# EasyEDA Pro project ProPrj_cheap-board-max-10_2026-05-07.epro, board PCB1
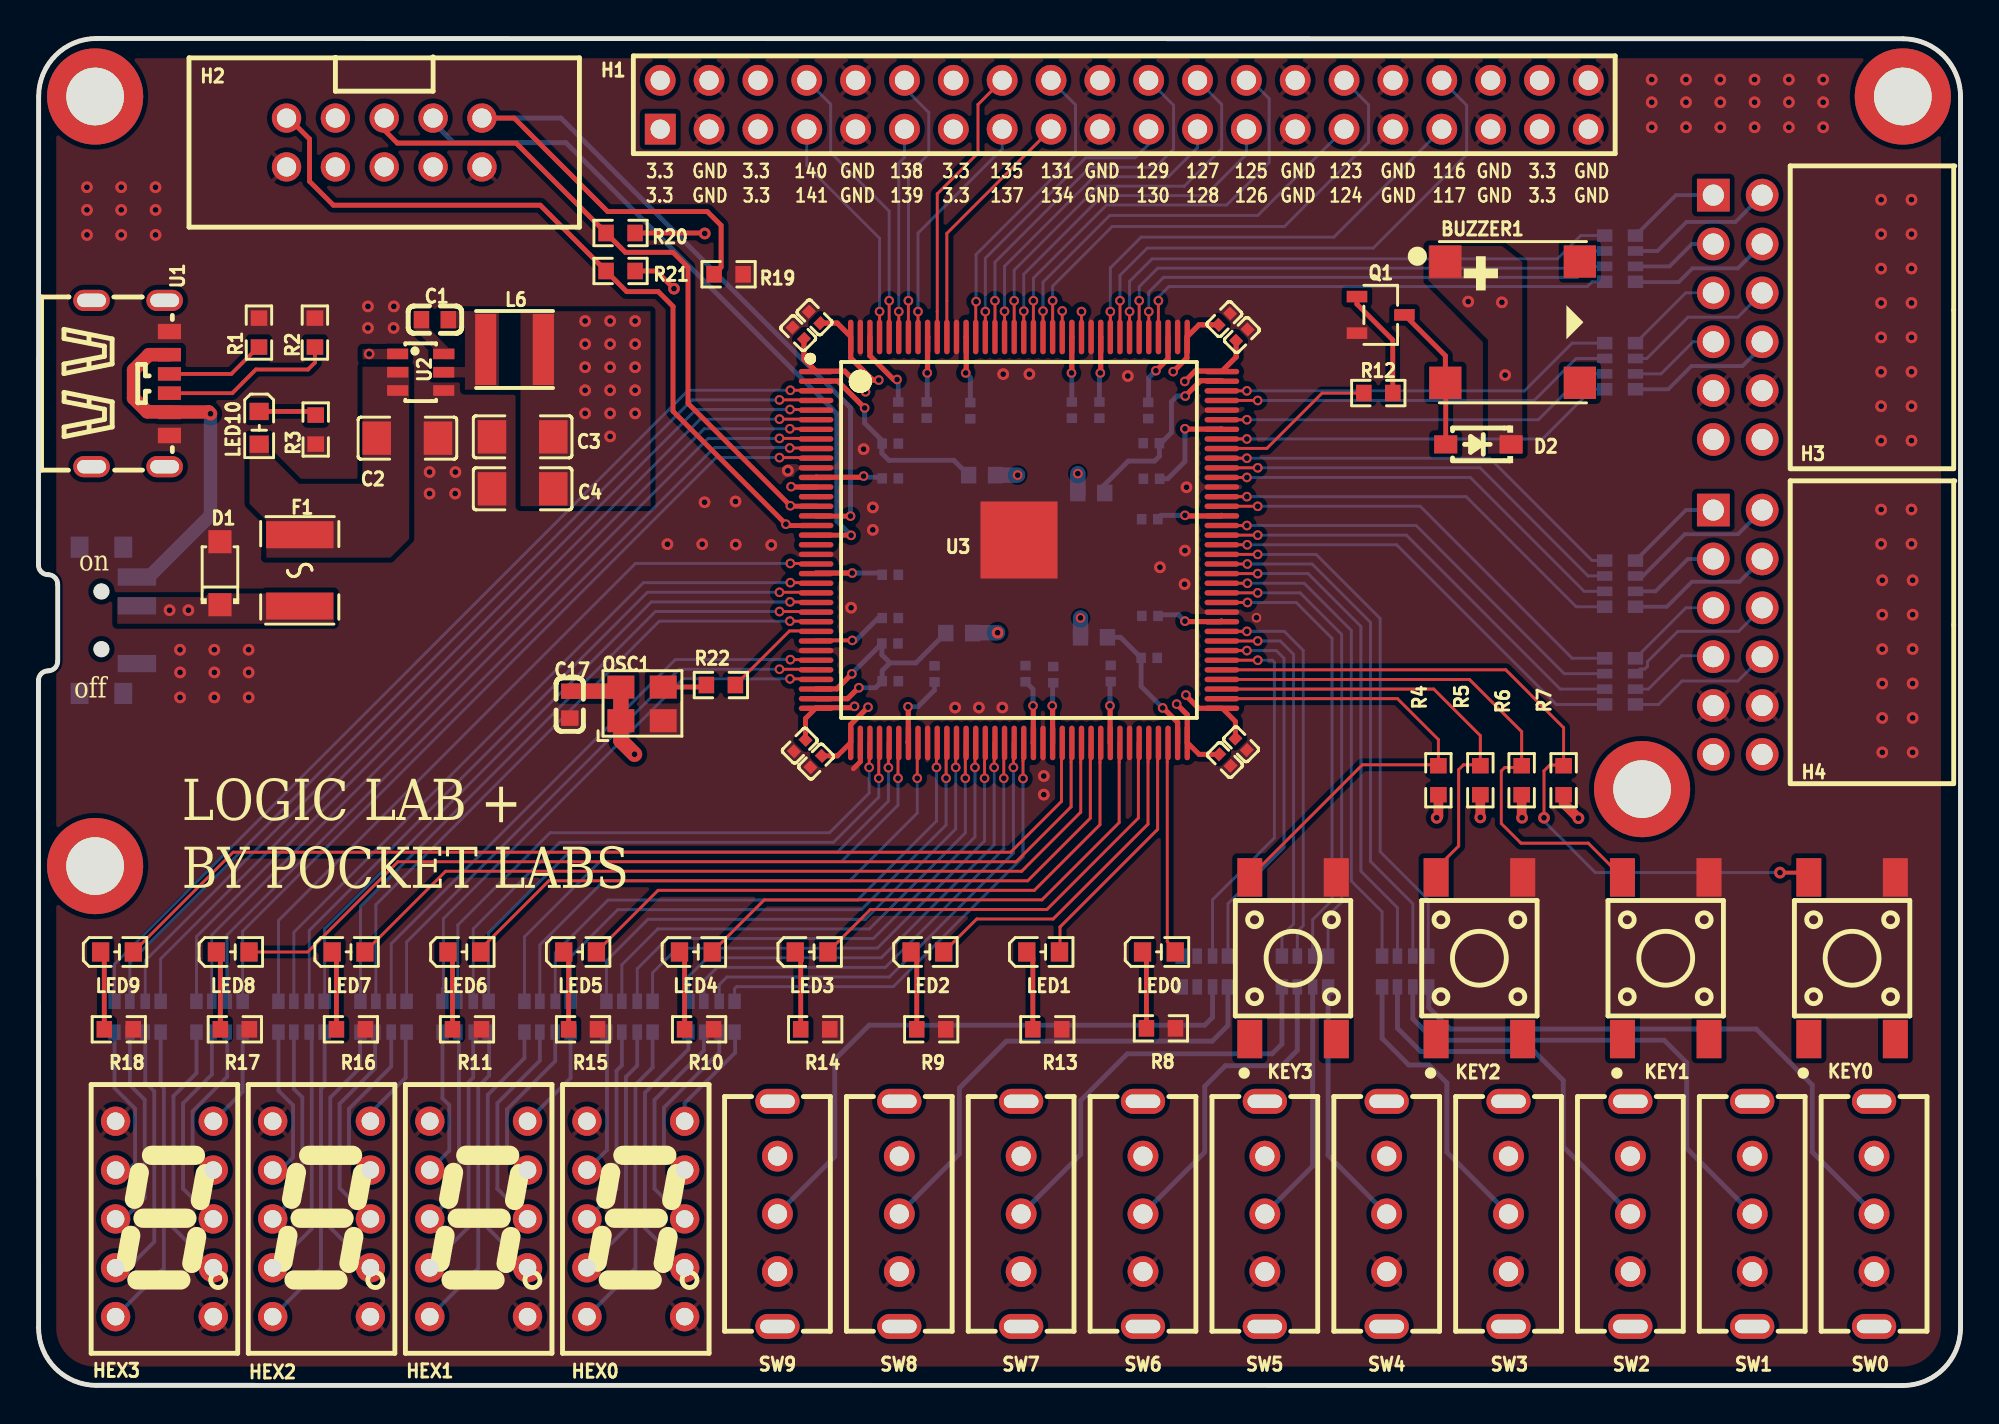
[diagram p6: board, top side]
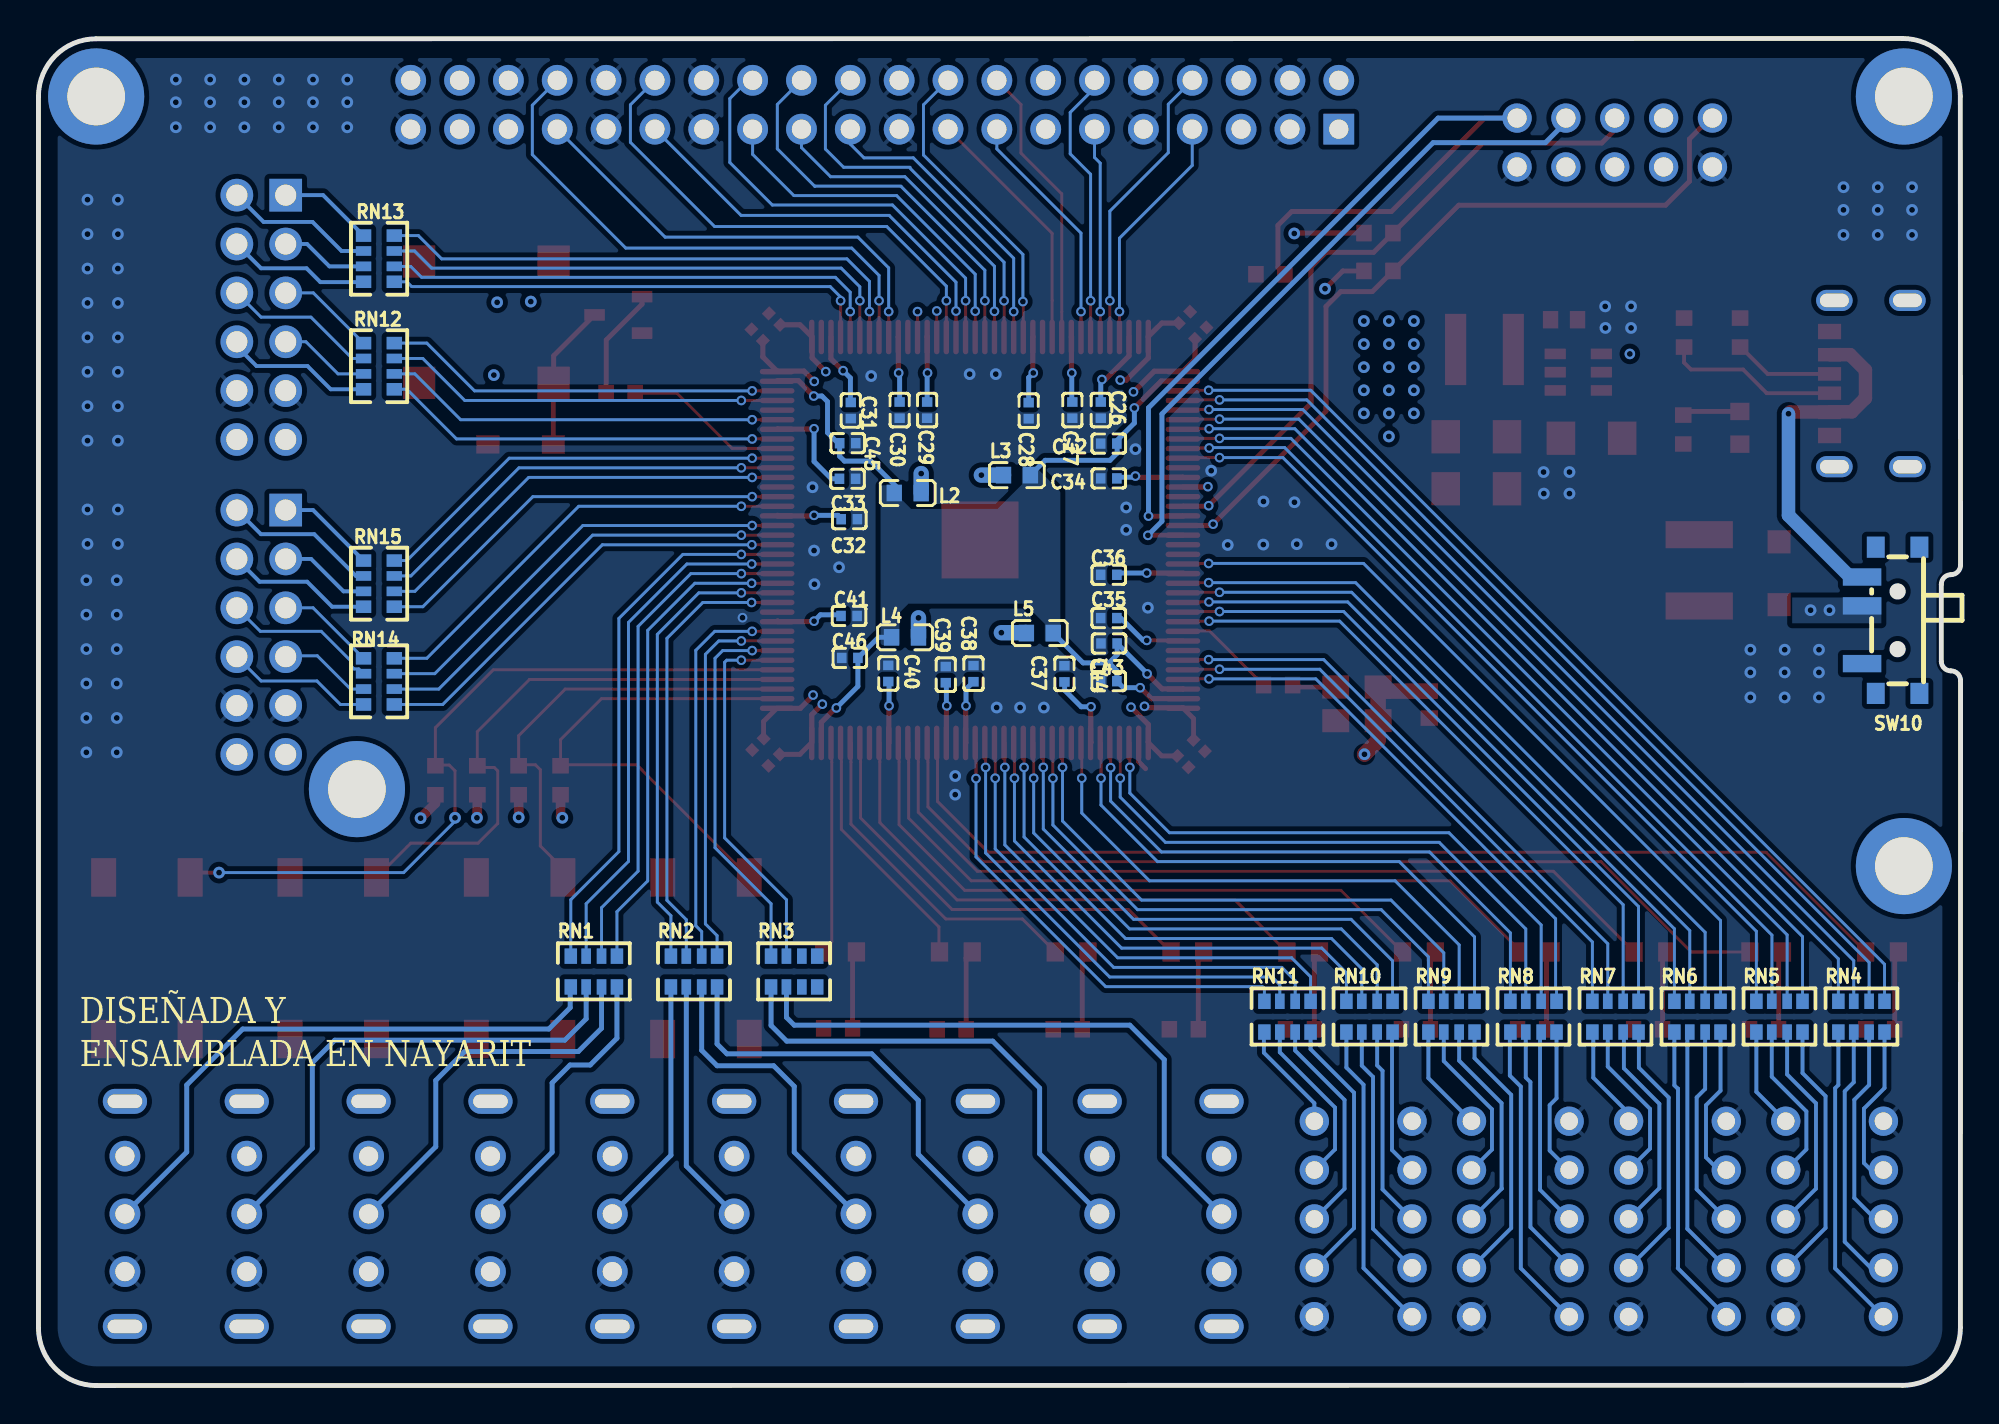
[diagram p7: board, bottom side, seen from below]

Outline 99.95 x 70.02 mm; copper layers: Top Layer, Inner1, Inner2, Bottom Layer. Coordinates in mm from the lower left corner of the outline.
Outline path: 0,36.65 arc(0.15,37) 0.5,37.15 arc(0.85,37.29) 1,37.65 1,41.65 arc(0.85,42) 0.5,42.15 arc(0.15,42.29) 0,42.65 0.01,67.01 arc(0.89,69.14) 3.02,70.02 96.95,70 arc(99.07,69.12) 99.95,67 99.95,3 arc(99.07,0.88) 96.95,0 3.01,0.01 arc(0.88,0.89) 0.01,3.01 0,36.65
Stack: Top Layer 0.035mm Outer layer thickness 1oz / Dielectric1 0.2104mm 7628 RC49% 8.6mil / Inner1 0.0152mm Inner layer thickness / Dielectric2 1.065mm 1.1mm H/HOZ Copper / Inner2 0.0152mm Inner layer thickness / Dielectric3 0.2104mm 7628 RC49% 8.6mil / Bottom Layer 0.035mm Outer layer thickness 1oz

## Design rules (mm)
template: Custom Config
spacing copperThickness1oz (default): track to track 0.102, other pairs 0.152 to 0.3
spacing copperThickness2oz: track to track 0.203, other pairs 0.152 to 0.3
track width copperThickness1oz (default): min 0.127, default 0.254, max 2.54
track width copperThickness2oz: min 0.203, default 0.254, max 2.54
differential pair differentialPair (default): width min 0.127, default 0.254, max 2.54; gap min 0.152, default 0.152
via viaSize (default): diameter min 0.5, default 0.61, max 10; hole min 0.3, default 0.305, max 6.3

## Placement (name value [footprint] x y rotation side)
BUZZER1  2.7kHz  [BUZ-SMD_4P-L7.5-W7.5-P7.59-TL]  76.65 55.27 0 top
C1  100nF  [C0603]  20.62 55.4 0 top
C2  22uF  [C1206]  19.19 49.24 180 top
C3  22uF  [C1206]  25.18 49.31 0 top
C4  22uF  [C1206]  25.18 46.61 0 top
C17  100nF  [C0603]  27.63 35.39 90 top
C18  100nF  [C0402]  40.36 55.52 315 top
C19  100nF  [C0402]  39.51 54.7 315 top
C20  100nF  [C0402]  61.67 55.43 225 top
C21  100nF  [C0402]  62.58 54.6 225 top
C22  100nF  [C0402]  39.59 33.26 45 top
C23  100nF  [C0402]  40.44 32.43 45 top
C24  100nF  [C0402]  61.7 32.51 135 top
C25  100nF  [C0402]  62.54 33.33 135 top
C26  100nF  [C0402]  44.71 50.7 90 bottom
C27  100nF  [C0402]  46.19 50.7 90 bottom
C28  100nF  [C0402]  48.46 50.67 90 bottom
C29  100nF  [C0402]  53.74 50.7 90 bottom
C30  100nF  [C0402]  55.17 50.7 90 bottom
C31  100nF  [C0402]  57.71 50.68 90 bottom
C32  100nF  [C0402]  57.79 45.03 0 bottom
C33  100nF  [C0402]  57.88 47.13 0 bottom
C34  100nF  [C0402]  44.29 47.15 180 bottom
C35  100nF  [C0402]  44.29 39.89 180 bottom
C36  100nF  [C0402]  44.29 42.14 180 bottom
C37  100nF  [C0402]  46.6 36.99 270 bottom
C38  100nF  [C0402]  51.33 37 270 bottom
C39  100nF  [C0402]  52.77 36.95 270 bottom
C40  100nF  [C0402]  55.76 37.01 270 bottom
C41  100nF  [C0402]  57.8 40 0 bottom
C42  100nF  [C0402]  44.29 48.96 180 bottom
C43  100nF  [C0402]  44.29 36.61 180 bottom
C44  100nF  [C0402]  44.28 38.57 180 bottom
C45  100nF  [C0402]  57.87 48.98 0 bottom
C46  100nF  [C0402]  57.76 37.82 180 bottom
D1  SMF5.0A  [SOD-123FL_L2.7-W1.8-LS3.8-RD]  9.44 42.22 90 top
D2  1N4148W-7-F  [SOD-123_L2.7-W1.6-LS3.7-RD-1]  74.88 48.92 180 top
F1  MF-MSMF050-2  [F1812]  13.59 42.37 270 top
H1  2.54-2*20  [HDR-TH_40P-P2.54-V-F-R2-C20-S2.54]  56.46 66.57 0 top
H2  2.54-2*5P简牛  [IDC-TH_10P-P2.54_C5665]  17.98 64.61 180 top
H3  HX PM2.54-2x6P WC  [HDR-TH_12P-P2.54-H-F-R2-C6-S2.54-W12.7-N]  88.36 55.52 90 top
H4  HX PM2.54-2x6P WC  [HDR-TH_12P-P2.54-H-F-R2-C6-S2.54-W12.7-N]  88.36 39.15 90 top
HEX0  FJ3161AH  [LED-SEG-TH_10P-L14.0-W7.5-P2.54-S5.08-TL]  31.06 8.66 0 top
HEX1  FJ3161AH  [LED-SEG-TH_10P-L14.0-W7.5-P2.54-S5.08-TL]  22.89 8.66 0 top
HEX2  FJ3161AH  [LED-SEG-TH_10P-L14.0-W7.5-P2.54-S5.08-TL]  14.72 8.66 0 top
HEX3  FJ3161AH  [LED-SEG-TH_10P-L14.0-W7.5-P2.54-S5.08-TL]  6.55 8.66 0 top
KEY0  KH-6X6X6H-STM  [SW-SMD_4P-L6.0-W6.0-P4.50-LS9.0_KH-6X6X6H-STM]  94.31 22.21 90 top
KEY1  KH-6X6X6H-STM  [SW-SMD_4P-L6.0-W6.0-P4.50-LS9.0_KH-6X6X6H-STM]  84.62 22.21 90 top
KEY2  KH-6X6X6H-STM  [SW-SMD_4P-L6.0-W6.0-P4.50-LS9.0_KH-6X6X6H-STM]  74.93 22.21 90 top
KEY3  KH-6X6X6H-STM  [SW-SMD_4P-L6.0-W6.0-P4.50-LS9.0_KH-6X6X6H-STM]  65.24 22.21 90 top
L2  BLM18AG601SN1D  [L0603]  54.75 46.39 0 bottom
L3  BLM18AG601SN1D  [L0603]  49.07 47.32 180 bottom
L4  BLM18AG601SN1D  [L0603]  54.89 38.89 0 bottom
L5  BLM18AG601SN1D  [L0603]  47.88 39.11 180 bottom
L6  3.9uH  [IND-SMD_TNR4030S-3R9MTF]  24.76 53.85 0 top
LED0  YLED0603R  [LED0603-FD]  58.26 22.53 180 top
LED1  YLED0603R  [LED0603-FD]  52.24 22.53 180 top
LED2  YLED0603R  [LED0603-FD]  46.22 22.53 180 top
LED3  YLED0603R  [LED0603-FD]  40.2 22.53 180 top
LED4  YLED0603R  [LED0603-FD]  34.18 22.53 180 top
LED5  YLED0603R  [LED0603-FD]  28.16 22.53 180 top
LED6  YLED0603R  [LED0603-FD]  22.14 22.53 180 top
LED7  YLED0603R  [LED0603-FD]  16.12 22.53 180 top
LED8  YLED0603R  [LED0603-FD]  10.1 22.53 180 top
LED9  YLED0603R  [LED0603-FD]  4.08 22.53 180 top
LED10  YLED0603R  [LED0603-FD]  11.48 49.78 90 top
NOREF  -  [Pad_e109]  2.95 27 0 top
NOREF#2  -  [Pad_e107]  96.95 67 0 top
NOREF#3  -  [Pad_e106]  2.95 67 0 top
NOREF#4  -  [Pad_e110]  83.39 31 0 top
OSC1  50MHz  [OSC-SMD_4P-L3.2-W2.5-BL]  31.39 35.43 0 top
Q1  MMBT3904LT1G  [SOT-23-3_L2.9-W1.6-P1.90-LS2.8-BR]  69.8 55.65 180 top
R1  5.1kΩ  [R0603]  11.47 54.73 270 top
R2  5.1kΩ  [R0603]  14.38 54.73 270 top
R3  10kΩ  [R0603]  14.42 49.69 90 top
R4  10kΩ  [R0603]  72.8 31.46 270 top
R5  10kΩ  [R0603]  74.98 31.46 270 top
R6  10kΩ  [R0603]  77.13 31.46 270 top
R7  10kΩ  [R0603]  79.31 31.46 270 top
R8  1kΩ  [R0603]  58.37 18.56 180 top
R9  1kΩ  [R0603]  46.42 18.52 180 top
R10  1kΩ  [R0603]  34.35 18.52 180 top
R11  1kΩ  [R0603]  22.28 18.52 180 top
R12  1kΩ  [R0603]  69.67 51.58 180 top
R13  1kΩ  [R0603]  52.46 18.52 180 top
R14  1kΩ  [R0603]  40.39 18.52 180 top
R15  1kΩ  [R0603]  28.32 18.52 180 top
R16  1kΩ  [R0603]  16.25 18.52 180 top
R17  1kΩ  [R0603]  10.21 18.52 180 top
R18  1kΩ  [R0603]  4.18 18.52 180 top
R19  1kΩ  [R0603]  35.89 57.76 0 top
R20  10kΩ  [R0603]  30.27 59.9 0 top
R21  10kΩ  [R0603]  30.27 57.93 0 top
R22  33  [R0603]  35.49 36.41 180 top
RN1  10kΩ  [RES-ARRAY-SMD_0603-8P-L3.2-W1.6-BL]  71.07 21.52 180 bottom
RN2  10kΩ  [RES-ARRAY-SMD_0603-8P-L3.2-W1.6-BL]  65.86 21.52 180 bottom
RN3  10kΩ  [RES-ARRAY-SMD_0603-8P-L3.2-W1.6-BL]  60.65 21.52 180 bottom
RN4  1kΩ  [RES-ARRAY-SMD_0603-8P-L3.2-W1.6-BL]  5.15 19.17 180 bottom
RN5  1kΩ  [RES-ARRAY-SMD_0603-8P-L3.2-W1.6-BL]  9.42 19.17 180 bottom
RN6  1kΩ  [RES-ARRAY-SMD_0603-8P-L3.2-W1.6-BL]  13.68 19.17 180 bottom
RN7  1kΩ  [RES-ARRAY-SMD_0603-8P-L3.2-W1.6-BL]  17.94 19.17 180 bottom
RN8  1kΩ  [RES-ARRAY-SMD_0603-8P-L3.2-W1.6-BL]  22.21 19.17 180 bottom
RN9  1kΩ  [RES-ARRAY-SMD_0603-8P-L3.2-W1.6-BL]  26.47 19.17 180 bottom
RN10  1kΩ  [RES-ARRAY-SMD_0603-8P-L3.2-W1.6-BL]  30.73 19.17 180 bottom
RN11  1kΩ  [RES-ARRAY-SMD_0603-8P-L3.2-W1.6-BL]  35 19.17 180 bottom
RN12  100Ω  [RES-ARRAY-SMD_0603-8P-L3.2-W1.6-BL]  82.24 52.98 270 bottom
RN13  100Ω  [RES-ARRAY-SMD_0603-8P-L3.2-W1.6-BL]  82.24 58.57 270 bottom
RN14  100Ω  [RES-ARRAY-SMD_0603-8P-L3.2-W1.6-BL]  82.24 36.6 270 bottom
RN15  100Ω  [RES-ARRAY-SMD_0603-8P-L3.2-W1.6-BL]  82.24 41.68 270 bottom
SW0  SS12F44G4  [SW-TH_SHOU-HAN_SS12F44G4]  95.45 8.92 90 top
SW1  SS12F44G4  [SW-TH_SHOU-HAN_SS12F44G4]  89.11 8.92 90 top
SW2  SS12F44G4  [SW-TH_SHOU-HAN_SS12F44G4]  82.78 8.92 90 top
SW3  SS12F44G4  [SW-TH_SHOU-HAN_SS12F44G4]  76.44 8.92 90 top
SW4  SS12F44G4  [SW-TH_SHOU-HAN_SS12F44G4]  70.11 8.92 90 top
SW5  SS12F44G4  [SW-TH_SHOU-HAN_SS12F44G4]  63.77 8.92 90 top
SW6  SS12F44G4  [SW-TH_SHOU-HAN_SS12F44G4]  57.43 8.92 90 top
SW7  SS12F44G4  [SW-TH_SHOU-HAN_SS12F44G4]  51.1 8.92 90 top
SW8  SS12F44G4  [SW-TH_SHOU-HAN_SS12F44G4]  44.76 8.92 90 top
SW9  SS12F44G4  [SW-TH_SHOU-HAN_SS12F44G4]  38.43 8.92 90 top
SW10  MK-12C02-G020  [SW-SMD_MK-12C02-G020]  3.63 39.77 90 bottom
U1  USB-TYPE-C-009  [TYPE-C-SMD_TYPE-C-6P]  4.79 52.08 270 top
U2  AP63203WU-7  [TSOT-26_L2.9-W1.6-P0.95-LS2.8-BL]  19.88 52.67 270 top
U3  10M02SCE144C8G  [EQFP-144_L20.0-W20.0-P0.50-LS22.0-BL-EP4.0]  50.99 43.95 270 top

## Footprints (pads in the part's own frame, mm; a bottom-side part is the same pattern mirrored in y, then rotated)
BUZ-SMD_4P-L7.5-W7.5-P7.59-TL
  rect 1.681x1.68 smd: 1(-3.498,3.15) 2(-3.498,-3.15) 3(3.498,-3.15) 4(3.498,3.15)
C0402
  rect 0.5x0.54 smd: 1(-0.42,0) 2(0.42,0)
C0603
  rect 0.8x0.9 smd: 1(-0.7,0) 2(0.7,0)
C1206
  rect 1.485x1.728 smd: 1(-1.593,0) 2(1.593,0)
EQFP-144_L20.0-W20.0-P0.50-LS22.0-BL-EP4.0
  oval 0.28x1.8 smd: 1(-8.75,-10.55) 2(-8.25,-10.55) 3(-7.75,-10.55) 4(-7.25,-10.55) 5(-6.75,-10.55) 6(-6.25,-10.55) 7(-5.75,-10.55) 8(-5.25,-10.55) 9(-4.75,-10.55) 10(-4.25,-10.55) 11(-3.75,-10.55) 12(-3.25,-10.55) 13(-2.75,-10.55) 14(-2.25,-10.55) 15(-1.75,-10.55) 16(-1.25,-10.55) 17(-0.75,-10.55) 18(-0.25,-10.55) 19(0.25,-10.55) 20(0.75,-10.55) 21(1.25,-10.55) 22(1.75,-10.55) 23(2.25,-10.55) 24(2.75,-10.55) 25(3.25,-10.55) 26(3.75,-10.55) 27(4.25,-10.55) 28(4.75,-10.55) 29(5.25,-10.55) 30(5.75,-10.55) 31(6.25,-10.55) 32(6.75,-10.55) 33(7.25,-10.55) 34(7.75,-10.55) 35(8.25,-10.55) 36(8.75,-10.55) 73(8.75,10.55) 74(8.25,10.55) 75(7.75,10.55) 76(7.25,10.55) 77(6.75,10.55) 78(6.25,10.55) 79(5.75,10.55) 80(5.25,10.55) 81(4.75,10.55) 82(4.25,10.55) 83(3.75,10.55) 84(3.25,10.55) 85(2.75,10.55) 86(2.25,10.55) 87(1.75,10.55) 88(1.25,10.55) 89(0.75,10.55) 90(0.25,10.55) 91(-0.25,10.55) 92(-0.75,10.55) 93(-1.25,10.55) 94(-1.75,10.55) 95(-2.25,10.55) 96(-2.75,10.55) 97(-3.25,10.55) 98(-3.75,10.55) 99(-4.25,10.55) 100(-4.75,10.55) 101(-5.25,10.55) 102(-5.75,10.55) 103(-6.25,10.55) 104(-6.75,10.55) 105(-7.25,10.55) 106(-7.75,10.55) 107(-8.25,10.55) 108(-8.75,10.55)
  oval 1.8x0.28 smd: 37(10.55,-8.75) 38(10.55,-8.25) 39(10.55,-7.75) 40(10.55,-7.25) 41(10.55,-6.75) 42(10.55,-6.25) 43(10.55,-5.75) 44(10.55,-5.25) 45(10.55,-4.75) 46(10.55,-4.25) 47(10.55,-3.75) 48(10.55,-3.25) 49(10.55,-2.75) 50(10.55,-2.25) 51(10.55,-1.75) 52(10.55,-1.25) 53(10.55,-0.75) 54(10.55,-0.25) 55(10.55,0.25) 56(10.55,0.75) 57(10.55,1.25) 58(10.55,1.75) 59(10.55,2.25) 60(10.55,2.75) 61(10.55,3.25) 62(10.55,3.75) 63(10.55,4.25) 64(10.55,4.75) 65(10.55,5.25) 66(10.55,5.75) 67(10.55,6.25) 68(10.55,6.75) 69(10.55,7.25) 70(10.55,7.75) 71(10.55,8.25) 72(10.55,8.75) 109(-10.55,8.75) 110(-10.55,8.25) 111(-10.55,7.75) 112(-10.55,7.25) 113(-10.55,6.75) 114(-10.55,6.25) 115(-10.55,5.75) 116(-10.55,5.25) 117(-10.55,4.75) 118(-10.55,4.25) 119(-10.55,3.75) 120(-10.55,3.25) 121(-10.55,2.75) 122(-10.55,2.25) 123(-10.55,1.75) 124(-10.55,1.25) 125(-10.55,0.75) 126(-10.55,0.25) 127(-10.55,-0.25) 128(-10.55,-0.75) 129(-10.55,-1.25) 130(-10.55,-1.75) 131(-10.55,-2.25) 132(-10.55,-2.75) 133(-10.55,-3.25) 134(-10.55,-3.75) 135(-10.55,-4.25) 136(-10.55,-4.75) 137(-10.55,-5.25) 138(-10.55,-5.75) 139(-10.55,-6.25) 140(-10.55,-6.75) 141(-10.55,-7.25) 142(-10.55,-7.75) 143(-10.55,-8.25) 144(-10.55,-8.75)
  rect 4x4 smd: 145(0,0)
F1812
  rect 1.407x3.499 smd: 1(-1.853,0) 2(1.853,0)
HDR-TH_12P-P2.54-H-F-R2-C6-S2.54-W12.7-N
  rect 1.7x1.7 hole 1.1: 1(6.35,1.27)
  round 1.7 hole 1.1: 2(6.35,-1.27) 3(3.81,1.27) 4(3.81,-1.27) 5(1.27,1.27) 6(1.27,-1.27) 7(-1.27,1.27) 8(-1.27,-1.27) 9(-3.81,1.27) 10(-3.81,-1.27) 11(-6.35,1.27) 12(-6.35,-1.27)
HDR-TH_40P-P2.54-V-F-R2-C20-S2.54
  rect 1.6x1.6 hole 1: 1(-24.13,-1.27)
  round 1.6 hole 1: 2(-24.13,1.27) 3(-21.59,-1.27) 4(-21.59,1.27) 5(-19.05,-1.27) 6(-19.05,1.27) 7(-16.51,-1.27) 8(-16.51,1.27) 9(-13.97,-1.27) 10(-13.97,1.27) 11(-11.43,-1.27) 12(-11.43,1.27) 13(-8.89,-1.27) 14(-8.89,1.27) 15(-6.35,-1.27) 16(-6.35,1.27) 17(-3.81,-1.27) 18(-3.81,1.27) 19(-1.27,-1.27) 20(-1.27,1.27) 21(1.27,-1.27) 22(1.27,1.27) 23(3.81,-1.27) 24(3.81,1.27) 25(6.35,-1.27) 26(6.35,1.27) 27(8.89,-1.27) 28(8.89,1.27) 29(11.43,-1.27) 30(11.43,1.27) 31(13.97,-1.27) 32(13.97,1.27) 33(16.51,-1.27) 34(16.51,1.27) 35(19.05,-1.27) 36(19.05,1.27) 37(21.59,-1.27) 38(21.59,1.27) 39(24.13,-1.27) 40(24.13,1.27)
IDC-TH_10P-P2.54_C5665
  round 1.524 hole 1: 1(-5.08,-1.27) 2(-5.08,1.27) 3(-2.54,-1.27) 4(-2.54,1.27) 5(0,-1.27) 6(0,1.27) 7(2.54,-1.27) 8(2.54,1.27) 9(5.08,-1.27) 10(5.08,1.27)
IND-SMD_TNR4030S-3R9MTF
  rect 1.1x3.7 smd: 1(-1.5,0) 2(1.5,0)
L0603
  rect 0.8x0.864 smd: 1(-0.7,0) 2(0.7,0)
LED0603-FD
  rect 0.9x1 smd: 1(-0.85,0) 2(0.85,0)
LED-SEG-TH_10P-L14.0-W7.5-P2.54-S5.08-TL
  round 1.524 hole 0.914: 1(-2.54,5.08) 2(-2.54,2.54) 3(-2.54,0) 4(-2.54,-2.54) 5(-2.54,-5.08) 6(2.54,-5.08) 7(2.54,-2.54) 8(2.54,0) 9(2.54,2.54) 10(2.54,5.08)
OSC-SMD_4P-L3.2-W2.5-BL
  rect 1.4x1.2 smd: 1(-1.1,-0.875) 2(1.1,-0.875) 3(1.1,0.875) 4(-1.1,0.875)
Pad_e106
  round 5 hole 3: 1(0,0)
Pad_e107
  round 5 hole 3: 1(0,0)
Pad_e109
  round 5 hole 3: 1(0,0)
Pad_e110
  round 5 hole 3: 1(0,0)
R0603
  rect 0.806x0.864 smd: 1(-0.753,0) 2(0.753,0)
RES-ARRAY-SMD_0603-8P-L3.2-W1.6-BL
  rect 0.65x0.8 smd: 1(-1.2,-0.8) 4(1.2,-0.8) 5(1.2,0.8) 8(-1.2,0.8)
  rect 0.5x0.8 smd: 2(-0.4,-0.8) 3(0.4,-0.8) 6(0.4,0.8) 7(-0.4,0.8)
SOD-123_L2.7-W1.6-LS3.7-RD-1
  rect 1.2x0.95 smd: 1(-1.7,0) 2(1.7,0)
SOD-123FL_L2.7-W1.8-LS3.8-RD
  rect 1.2x1.2 smd: 1(-1.635,0) 2(1.635,0)
SOT-23-3_L2.9-W1.6-P1.90-LS2.8-BR
  rect 1.07x0.6 smd: 1(1.235,-0.95) 2(1.235,0.95) 3(-1.235,0)
SW-SMD_4P-L6.0-W6.0-P4.50-LS9.0_KH-6X6X6H-STM
  rect 2x1.3 smd: 1(-4.2,2.25) 2(4.2,2.25) 3(-4.2,-2.25) 4(4.2,-2.25)
SW-SMD_MK-12C02-G020
  rect 0.9x2 smd: 1(-2.25,1.49) 2(0.75,1.49) 3(2.25,1.49)
  rect 1.1x0.93 smd: 4(3.8,0.779) 5(3.8,-1.49) 6(-3.8,-1.49) 7(-3.8,0.779)
SW-TH_SHOU-HAN_SS12F44G4
  round 1.6 hole 1: 1(-3,0) 2(0,0) 3(3,0)
  oval 1.3x2.3 hole 0.7x1.8: 4(5.85,0) 5(-5.85,0)
TSOT-26_L2.9-W1.6-P0.95-LS2.8-BL
  rect 0.55x1.1 smd: 1(-0.95,-1.2) 2(0,-1.2) 3(0.95,-1.2) 4(0.95,1.2) 5(0,1.2) 6(-0.95,1.2)
TYPE-C-SMD_TYPE-C-6P
  oval 1.1x1.9 hole 0.7x1.5: 7(-4.32,1.775) 7(-4.32,-2.025) 7(4.32,1.775) 7(4.32,-2.025)
  rect 0.7x1.2 smd: A5(-0.5,2.025) A9(1.5,2.025) B5(0.5,2.025) B9(-1.5,2.025)
  rect 0.8x1.2 smd: A12(2.7,2.025) B12(-2.7,2.025)

## Nets
As in the schematic.

Pads without a net: BUZZER1 3 4; H2 6 7 8; KEY0 1 3; KEY1 1 3; KEY2 1 3; KEY3 1 3; NOREF 1; NOREF#2 1; NOREF#3 1; NOREF#4 1; RN3 3 4 5 6; SW0 4 5; SW1 4 5; SW2 4 5; SW3 4 5; SW4 4 5; SW5 4 5; SW6 4 5; SW7 4 5; SW8 4 5; SW9 4 5; SW10 1 4 5 6 7; U1 7; U3 14 19

## Via types
v1: diameter 0.61, hole 0.305, Top Layer to Bottom Layer, 131 vias
v2: diameter 0.5, hole 0.305, Top Layer to Bottom Layer, 5 vias
v3: diameter 0.5, hole 0.3, Top Layer to Bottom Layer, 109 vias
v4: diameter 0.55, hole 0.305, Top Layer to Bottom Layer, 1 via

## Routing (per net, layer and track width the routed paths; a pad name or vN(x,y) marks a point on that pad's centre or on a via; arc(x,y) is an arc through that point)
3.3V: length 118.2
  Top Layer w0.152: 54.24,54.52 v3(54.24,55.82) ; 53.24,54.52 v3(53.24,55.85)
  Top Layer w0.2: 40.42,38.73 v3(42.32,38.73) ; 48.22,54.53 48.22,54.52
  Top Layer w0.254: 31.02,57.93 32.12,57.93 v1(33.05,57.01) ; 31.02,59.9 34.62,59.9 v1(34.65,59.88) ; 61.56,35.2 62.24,34.52 62.24,33.63 ; 59.74,33.42 60.35,32.81 61.4,32.81 ; 40.73,32.73 41.54,32.73 42.24,33.42 ; C22.2 39.88,34.67 40.44,35.22
  Top Layer w0.27: v3(59.62,39.73) 59.63,39.73 59.65,39.71 61.48,39.71 61.51,39.73 61.52,39.73 ; U3.64 55.73,33.4 55.73,35.32 v3(55.72,35.33) ; v3(52.72,35.33) 52.73,35.31 52.73,33.4 ; 53.73,54.5 53.73,52.65 v3(53.72,52.63) ; 53.73,54.5 53.73,54.51 ; 53.73,54.5 U3.121 ; U3.56 51.73,33.41 51.73,35.32 v3(51.72,35.33) ; 61.56,35.2 60.33,35.2 59.67,35.86 v3(59.67,35.89) ; v3(59.62,45.23) 59.65,45.2 61.49,45.2 61.52,45.23 ; v3(43.01,51.65) 43,51.65 41.93,52.72 40.44,52.72 39.8,53.35 C19.2 ; U3.132 48.24,54.49 48.24,52.66 v3(48.22,52.63) ; 43.24,54.52 43.24,53.52 44.47,52.29 v3(44.65,52.29) ; v3(46.22,52.63) 46.23,52.65 46.23,54.5 ; 59.74,54.52 60.35,55.13 C20.2 ; 46.23,54.5 U3.136 ; 46.23,54.5 46.23,54.51 ; 61.52,52.73 60.15,52.73 v3(59.61,52.19) ; v3(59.62,49.73) 59.64,49.71 61.5,49.71 61.52,49.73 ; v3(43.14,35.26) 42.24,34.36 42.24,33.45 42.22,33.43 ; U3.72 59.74,34.86 v3(59.19,35.41) ; v3(58.11,52.75) 58.12,52.75 58.74,53.37 58.74,54.51 ; 45.22,33.43 45.23,33.43 45.23,33.43 45.23,35.27 v3(45.22,35.28) ; 62.28,54.3 62.28,53.46 61.54,52.72 ; v3(42.43,35.3) 42.36,35.23 40.42,35.23 ; v3(55.22,52.63) 55.23,52.65 55.23,54.49 55.23,54.5 U3.118 ; v3(39.14,46.72) 39.15,46.7 40.44,46.7 ; v3(59.01,52.7) 59.72,53.41 59.72,54.53 ; 40.42,42.23 v3(42.32,42.23) ; 40.65,55.22 41.53,55.22 42.24,54.52 42.24,53.41 43.39,52.26 v3(43.7,52.26) ; v3(42.91,47.27) 42.86,47.27 42.8,47.21 40.44,47.21 U3.12
  Top Layer w0.5: 72.8,30.76 72.8,29.6 v1(72.71,29.51) ; 74.98,30.76 v1(74.98,29.53) ; v1(80.08,29.49) 79.31,30.26 79.31,30.69 ; v1(77.15,29.51) 77.13,29.53 77.13,30.66
  Top Layer w0.8: v1(31,32.81) 30.29,33.52 OSC1.1 30.29,36.09 ; 30.29,36.09 OSC1.4 ; 30.29,36.09 C17.2
  Bottom Layer w0.254: C32.2 58.21,45.07 58.37,45.23 v3(59.62,45.23) ; v3(59.62,39.73) 59.29,40.06 58.22,40.06 ; v3(42.32,42.23) 43.68,42.23 43.71,42.2 ; v3(42.91,47.27) 42.97,47.21 43.93,47.21 ; 46.19,51.18 46.22,51.21 v3(46.22,52.63) ; 48.46,51.15 48.46,52.39 v3(48.22,52.63) ; v3(45.22,35.28) 45.73,35.28 46.59,36.14 46.59,36.67 ; v3(53.72,52.63) 53.74,52.61 53.74,51.18 ; v3(58.11,52.75) 57.73,52.37 57.73,51.18 57.71,51.16 ; 55.65,36.61 55.72,36.54 v3(55.72,35.33) ; 52.74,36.56 52.74,35.35 v3(52.72,35.33) ; 43.67,39.89 42.51,38.73 v3(42.32,38.73) ; C33.2 58.72,47.13 59.62,48.03 v3(59.62,49.73) ; 55.17,51.18 55.17,52.58 v3(55.22,52.63) ; v3(51.72,35.33) 51.72,36.19 51.3,36.61 ; 44.71,51.18 44.71,52.23 v3(44.65,52.29)
  Bottom Layer w0.8: v1(49.88,39.13) 48.63,39.13 48.62,39.14 ; L3.1 v2(50.92,47.32) ; L4.1 v2(54.19,39.9) ; L2.1 v2(54.05,47.4)
  vias: v1(28.43,55.33) v1(28.43,54.13) v1(28.43,52.93) v1(28.43,51.73) v1(28.43,50.53) v1(29.73,55.33) v1(29.73,54.13) v1(29.73,52.93) v1(29.73,51.73) v1(29.73,50.53) v1(29.73,49.33) v1(31.03,55.33) v1(31.03,54.13) v1(31.03,52.93) v1(31.03,51.73) v1(31.03,50.53) v1(74.35,56.34) v1(76.1,56.3) v1(76.27,52.52) v4(17.2,53.62)
3.3VA: length 42.2
  Top Layer w0.27: 40.42,52.23 40.44,52.21 41.56,52.21 v3(42.96,50.81) ; v3(42.66,36.27) 42.64,36.27 42.07,35.7 U3.35 ; 61.52,52.23 60.43,52.23 v3(59.63,51.43) ; U3.71 59.24,34.47 58.49,35.22 v3(58.46,35.22) ; U3.34 40.44,36.21 41.52,36.21 v3(42.3,36.99)
  Bottom Layer w0.254: 44.28,37.56 43.86,37.98 C44.2 42.3,37.01 v3(42.3,36.99) ; 44.28,37.56 43.87,37.16 C43.2 43.53,36.27 v3(42.66,36.27) ; 44.28,37.56 45.63,37.56 L5.2 ; C45.2 58.29,48.3 58.04,48.05 56.67,48.05 55.28,46.66 ; v3(58.46,35.22) 57.34,36.34 C46.2 56.27,38.89 L4.2 ; L3.2 47.6,48.09 44.23,48.09 43.86,48.46 43.86,48.94 C42.2 43.87,49.11 42.96,50.03 v3(42.96,50.81) ; v3(59.63,51.43) 59.21,51.43 58.92,51.14 58.92,49.53 58.33,48.94
+5V:
  vias: v1(6.82,40.3) v1(7.8,40.3)
GND: length 1.5
  Top Layer w0.254: U3.38 42.74,32.42 42.38,32.06
  vias: v1(2.52,62.28) v1(2.52,61.11) v1(2.52,59.81) v1(4.3,62.28) v1(4.31,61.11) v1(4.31,59.81) v1(6.09,62.28) v1(6.09,61.11) v1(6.09,59.81) v1(7.36,38.25) v1(7.36,37.06) v1(7.36,35.77) v1(9.14,38.25) v1(9.15,37.06) v1(9.15,35.77) v1(10.93,38.25) v1(10.93,37.06) v1(10.93,35.77) v1(17.13,56.09) v1(17.13,54.97) v1(18.48,56.09) v1(18.47,54.97) v1(20.34,47.48) v1(20.34,46.36) v1(21.68,47.48) v1(21.67,46.36) v1(32.71,43.73) v1(34.52,43.73) v1(34.64,45.91) v1(36.25,45.95) v1(36.26,43.71) v1(38.11,43.69) v1(38.97,47.55) v1(42.26,40.43) v1(42.91,48.67) v1(43.39,45.64) v1(43.39,44.47) v1(47.67,35.24) v1(48.9,35.24) v1(50.17,52.57) v1(50.12,35.24) v1(51.53,52.57) v1(52.28,31.68) v1(52.28,30.71) v1(56.65,52.47) v1(58.32,42.53) v1(59.62,43.4) v1(59.6,41.65) v1(59.7,46.69) v1(83.89,67.88) v1(83.89,66.7) v1(83.89,65.4) v1(85.67,67.88) v1(85.67,66.7) v1(85.67,65.4) v1(87.45,67.88) v1(87.45,66.7) v1(87.45,65.4) v1(89.23,67.88) v1(89.24,66.7) v1(89.24,65.4) v1(91.02,67.88) v1(91.02,66.7) v1(91.02,65.4) v1(92.8,67.88) v1(92.8,66.7) v1(92.8,65.4) v1(95.82,61.64) v1(95.82,59.85) v1(95.82,58.06) v1(95.82,56.27) v1(95.82,54.48) v1(95.82,52.69) v1(95.82,50.9) v1(95.82,49.11) v1(95.82,45.53) v1(95.82,43.74) v1(95.88,41.86) v1(95.88,40.07) v1(95.88,38.28) v1(95.88,36.49) v1(95.88,34.7) v1(95.88,32.91) v1(97.4,61.64) v1(97.4,59.85) v1(97.4,58.06) v1(97.4,56.27) v1(97.4,54.48) v1(97.4,52.69) v1(97.4,50.9) v1(97.4,49.11) v1(97.4,45.53) v1(97.4,43.74) v1(97.46,41.86) v1(97.46,40.07) v1(97.46,38.28) v1(97.46,36.49) v1(97.46,34.7) v1(97.46,32.91) v2(63.34,39.91)
VCC: length 18.3
  Top Layer w0.7: 6.78,50.61 5.66,50.61 4.95,51.32 4.95,52.78 5.75,53.58 6.81,53.58 ; 6.88,50.6 8.85,50.6 v1(8.95,50.51)
  Bottom Layer w0.7: v1(8.95,50.51) 8.95,45.23 5.74,42.02 SW10.3
BUZZ: length 8.6
  Top Layer w0.152: R12.2 66.75,51.58 63.88,48.71 61.52,48.71 61.5,48.73
CLK: length 5.4
  Top Layer w0.152: 40.44,39.22 39.05,39.22 R22.1
HEX_0_A: length 24.4
  Top Layer w0.152: v3(51.2,31.55) 51.2,33.43
  Bottom Layer w0.152: RN11.8 36.2,20.62 36.31,20.73 44.45,20.73 51.2,27.48 v3(51.2,31.55)
HEX_0_B: length 24.7
  Top Layer w0.152: 50.7,33.43 v3(50.7,32.13)
  Bottom Layer w0.152: v3(50.7,32.13) 50.7,27.69 44.24,21.23 35.8,21.23 35.4,20.83 RN11.7
HEX_0_C: length 25
  Top Layer w0.152: 50.2,33.43 v3(50.2,31.57)
  Bottom Layer w0.152: RN11.6 34.6,21.04 35.29,21.73 44.04,21.73 50.2,27.89 v3(50.2,31.57)
HEX_0_D: length 26.7
  Top Layer w0.152: 49.2,33.43 v3(49.2,31.57)
  Bottom Layer w0.152: RN10.8 31.93,21.45 33.21,22.73 43.62,22.73 49.2,28.31 v3(49.2,31.57)
HEX_0_DP: length 25.3
  Top Layer w0.152: 49.7,33.43 v3(49.7,32.13)
  Bottom Layer w0.152: RN11.5 33.8,21.25 34.78,22.23 43.83,22.23 49.7,28.1 v3(49.7,32.13)
HEX_0_E: length 27
  Top Layer w0.152: 48.7,33.43 v3(48.7,32.13)
  Bottom Layer w0.152: v3(48.7,32.13) 48.7,28.51 43.41,23.23 32.71,23.23 31.13,21.66 RN10.7
HEX_0_F: length 27.6
  Top Layer w0.152: 47.7,33.43 v3(47.7,32.13)
  Bottom Layer w0.152: RN10.5 29.53,22.07 31.69,24.23 43,24.23 47.7,28.93 v3(47.7,32.13)
HEX_0_G: length 27.3
  Top Layer w0.152: 48.2,33.43 v3(48.2,31.57)
  Bottom Layer w0.152: RN10.6 30.33,21.87 32.2,23.73 43.21,23.73 48.2,28.72 v3(48.2,31.57)
HEX_1_A: length 29
  Top Layer w0.152: 47.2,33.43 v3(47.2,31.57)
  Bottom Layer w0.152: v3(47.2,31.57) 47.2,29.14 42.79,24.73 30.12,24.73 27.67,22.28 27.67,19.97
HEX_1_B: length 29.3
  Top Layer w0.152: 46.7,33.43 v3(46.7,32.13)
  Bottom Layer w0.152: v3(46.7,32.13) 46.7,29.34 42.59,25.23 29.61,25.23 26.87,22.49 26.87,19.97
HEX_1_C: length 29.1
  Top Layer w0.152: 45.7,33.43 v3(45.7,31.57)
  Bottom Layer w0.152: v3(45.7,31.57) 45.7,29.76 42.17,26.23 29.4,26.23 26.07,22.9 RN9.6
HEX_1_D: length 30.2
  Top Layer w0.152: 44.2,33.43 v3(44.2,32.11)
  Bottom Layer w0.152: 23.41,19.97 23.41,23.52 27.62,27.73 41.55,27.73 44.2,30.38 v3(44.2,32.11)
HEX_1_DP: length 28.9
  Top Layer w0.152: 44.7,33.43 v3(44.7,31.57)
  Bottom Layer w0.152: RN9.5 25.27,23.32 29.19,27.23 41.76,27.23 44.7,30.17 v3(44.7,31.57)
HEX_1_E: length 30.5
  Top Layer w0.152: 43.7,33.43 v3(43.7,31.57)
  Bottom Layer w0.152: RN8.7 22.61,23.73 27.11,28.23 41.34,28.23 43.7,30.58 v3(43.7,31.57)
HEX_1_F: length 28.8
  Top Layer w0.152: 40.4,36.73 v3(39.08,36.73)
  Bottom Layer w0.152: v3(39.08,36.73) 33.53,36.73 21.06,24.26 21.06,20.67 21.01,20.62 RN8.5
HEX_1_G: length 30.8
  Top Layer w0.152: 43.2,33.43 v3(43.2,32.13)
  Bottom Layer w0.152: v3(43.2,32.13) 43.2,30.79 41.14,28.73 26.6,28.73 21.81,23.94 21.81,19.97
HEX_2_A: length 30.2
  Top Layer w0.152: 40.4,37.23 v3(38.53,37.23)
  Bottom Layer w0.152: v3(38.53,37.23) 33.32,37.23 19.14,23.05 RN7.8
HEX_2_B: length 31.2
  Top Layer w0.152: 40.4,37.73 v3(39.1,37.73)
  Bottom Layer w0.152: RN7.7 18.34,22.96 33.11,37.73 v3(39.1,37.73)
HEX_2_C: length 34
  Top Layer w0.152: 40.4,39.73 v3(39.07,39.73)
  Bottom Layer w0.152: v3(39.07,39.73) 32.28,39.73 17.54,24.99 RN7.6
HEX_2_D: length 36.3
  Top Layer w0.152: 40.4,40.73 v3(39.08,40.73)
  Bottom Layer w0.152: RN6.8 14.88,23.74 31.87,40.73 v3(39.08,40.73)
HEX_2_DP: length 34.9
  Top Layer w0.152: 40.4,40.23 v3(38.53,40.23)
  Bottom Layer w0.152: RN7.5 16.74,24.9 32.08,40.23 v3(38.53,40.23)
HEX_2_E: length 37.3
  Top Layer w0.152: 40.4,41.23 v3(38.53,41.23)
  Bottom Layer w0.152: v3(38.53,41.23) 31.66,41.23 14.08,23.65 RN6.7
HEX_2_F: length 39.8
  Top Layer w0.152: 40.4,42.73 v3(39.1,42.73)
  Bottom Layer w0.152: v3(39.1,42.73) 31.04,42.73 12.48,24.17 RN6.5
HEX_2_G: length 38.2
  Top Layer w0.152: 40.4,41.73 v3(39.1,41.73)
  Bottom Layer w0.152: RN6.6 13.28,23.56 31.45,41.73 v3(39.1,41.73)
HEX_3_A: length 43.6
  Top Layer w0.152: 40.4,48.23 v3(38.53,48.23)
  Bottom Layer w0.152: v3(38.53,48.23) 35.24,48.23 10.62,23.61 RN5.8
HEX_3_B: length 44.5
  Top Layer w0.152: 40.4,48.73 v3(39.07,48.73)
  Bottom Layer w0.152: v3(39.07,48.73) 39.05,48.75 35.15,48.75 9.81,23.41 9.81,19.98 RN5.7
HEX_3_C: length 45.5
  Top Layer w0.152: 40.4,49.23 v3(38.53,49.23)
  Bottom Layer w0.152: RN5.6 9.02,23.42 34.82,49.23 v3(38.53,49.23)
HEX_3_D: length 47.9
  Top Layer w0.152: 40.4,50.23 v3(38.53,50.23)
  Bottom Layer w0.152: RN4.8 6.35,22.18 34.41,50.23 v3(38.53,50.23)
HEX_3_DP: length 46.5
  Top Layer w0.152: 40.4,49.73 v3(39.07,49.73)
  Bottom Layer w0.152: v3(39.07,49.73) 34.61,49.73 8.22,23.33 RN5.5
  Bottom Layer w0.2: 8.23,19.98 RN5.5
HEX_3_E: length 48.8
  Top Layer w0.152: 40.4,50.73 v3(39.08,50.73)
  Bottom Layer w0.152: RN4.7 5.55,22.08 34.2,50.73 v3(39.08,50.73)
HEX_3_F: length 50.7
  Top Layer w0.152: 40.4,51.73 v3(39.1,51.73)
  Bottom Layer w0.152: v3(39.1,51.73) 33.79,51.73 3.95,21.9 3.95,19.97
HEX_3_G: length 49.8
  Top Layer w0.152: 40.4,51.23 v3(38.53,51.23)
  Bottom Layer w0.152: v3(38.53,51.23) 33.99,51.23 4.75,21.99 4.75,19.97
  Bottom Layer w0.2: 4.78,20 4.75,19.97
KEY0: length 39.8
  Top Layer w0.152: 78.29,29.49 78.29,31.95 78.59,32.25 79.25,32.25 79.31,32.19 79.31,34.19 76.3,37.2 U3.77
  Top Layer w0.201: v1(90.56,26.66) 91.81,26.66 KEY0.2
  Bottom Layer w0.152: v1(90.56,26.66) 80.96,26.66 78.29,29.33 78.29,29.49
  vias: v1(78.29,29.51)
KEY1: length 29.9
  Top Layer w0.152: U3.76 74.41,36.7 77.13,33.98 77.13,32.16 77.09,32.12 76.25,32.12 76.07,31.94 76.07,29.21 77.09,28.19 80.59,28.19 KEY1.2
KEY2: length 23.5
  Top Layer w0.152: 72.22,26.41 73.85,28.04 73.85,32.01 74.1,32.26 74.98,32.26 74.98,33.78 72.55,36.2 U3.75
KEY3: length 25.7
  Top Layer w0.152: U3.74 70.67,35.7 72.8,33.57 72.8,32.26 68.84,32.26 KEY3.2
LED0: length 11.2
  Top Layer w0.152: 59.11,22.86 58.91,22.86 58.7,23.07 58.7,33.43
  Top Layer w0.201: LED0.1 59.11,22.86
LED1: length 13
  Top Layer w0.152: 58.2,33.43 58.2,28.91 53.12,23.83 53.12,22.53
  Top Layer w0.201: 53.12,22.53 LED1.1
LED2: length 17.6
  Top Layer w0.152: LED2.1 48.79,24.25 52.77,24.25 57.7,29.18 57.7,33.43
LED3: length 23
  Top Layer w0.152: LED3.1 43.26,24.75 52.44,24.75 57.2,29.5 57.2,33.43
LED4: length 28.1
  Top Layer w0.152: LED4.1 37.74,25.24 52.18,25.24 56.2,29.26 56.2,33.43
LED5: length 33.2
  Top Layer w0.152: 55.2,33.43 55.2,29.15 51.78,25.74 32.22,25.74 LED5.1
LED6: length 38.6
  Top Layer w0.152: 54.7,33.43 54.7,29.49 51.44,26.23 26.54,26.23 22.99,22.69 LED6.1
LED7: length 43.9
  Top Layer w0.152: 54.2,33.43 54.2,29.8 51.12,26.73 21.17,26.73 LED7.1
LED8: length 49.2
  Top Layer w0.152: LED8.1 14,22.53 18.69,27.22 50.84,27.22 53.7,30.08 53.7,33.43
LED9: length 54.6
  Top Layer w0.152: LED9.1 10.12,27.72 50.56,27.72 53.2,30.36 53.2,33.43
P1_IO1: length 28.6
  Top Layer w0.152: 56.74,54.52 v3(56.74,55.82)
  Bottom Layer w0.152: RN13.8 80.19,59.77 78.98,58.56 57.91,58.56 56.74,57.39 v3(56.74,55.82)
P1_IO2: length 27.6
  Top Layer w0.152: 57.24,54.52 v3(57.24,56.38)
  Bottom Layer w0.152: v3(57.24,56.38) 57.24,57.11 58.21,58.08 79.5,58.08 80.39,58.97 RN13.7
P1_IO3: length 26.6
  Top Layer w0.152: 57.74,54.52 v3(57.74,55.82)
  Bottom Layer w0.152: v3(57.74,55.82) 57.74,56.83 58.51,57.6 80.02,57.6 80.59,58.17 RN13.6
P1_IO4: length 25.6
  Top Layer w0.152: 58.24,54.52 v3(58.24,56.38)
  Bottom Layer w0.152: v3(58.24,56.38) 58.24,56.58 58.78,57.12 80.54,57.12 80.79,57.37 RN13.5
P1_IO5: length 20.9
  Top Layer w0.152: U3.106 v3(62.84,51.7)
  Bottom Layer w0.152: v3(62.84,51.7) 77.27,51.7 79.75,54.18 RN12.8
P1_IO6: length 20.8
  Top Layer w0.152: U3.105 v3(63.4,51.2)
  Bottom Layer w0.152: RN12.7 79.96,53.38 77.78,51.2 v3(63.4,51.2)
P1_IO7: length 20.9
  Top Layer w0.152: U3.103 v3(62.84,50.2)
  Bottom Layer w0.152: RN12.6 80.37,52.58 77.99,50.2 v3(62.84,50.2)
P1_IO8: length 21
  Top Layer w0.152: U3.101 v3(62.84,49.2)
  Bottom Layer w0.152: v3(62.84,49.2) 78.21,49.2 80.79,51.78 RN12.5
P2_IO1: length 22.1
  Top Layer w0.152: U3.99 v3(62.84,48.2)
  Bottom Layer w0.152: v3(62.84,48.2) 75.47,48.2 80.79,42.88 RN15.8
P2_IO2: length 22.2
  Top Layer w0.152: U3.98 v3(63.4,47.7)
  Bottom Layer w0.152: v3(63.4,47.7) 74.96,47.7 80.58,42.08 RN15.7
P2_IO3: length 22.4
  Top Layer w0.152: U3.97 v3(62.84,47.2)
  Bottom Layer w0.152: v3(62.84,47.2) 74.45,47.2 80.37,41.28 RN15.6
P2_IO4: length 22.3
  Top Layer w0.152: U3.95 v3(62.84,46.2)
  Bottom Layer w0.152: RN15.5 79.96,40.48 74.24,46.2 v3(62.84,46.2)
P2_IO5: length 23.2
  Top Layer w0.152: U3.94 v3(63.4,45.7)
  Bottom Layer w0.152: RN14.8 79.75,37.8 71.85,45.7 v3(63.4,45.7)
P2_IO6: length 23.1
  Top Layer w0.152: U3.92 v3(62.84,44.7)
  Bottom Layer w0.152: RN14.7 79.34,37 71.64,44.7 v3(62.84,44.7)
P2_IO7: length 23.2
  Top Layer w0.152: U3.91 v3(63.4,44.2)
  Bottom Layer w0.152: v3(63.4,44.2) 71.13,44.2 79.13,36.2 RN14.6
P2_IO8: length 23.3
  Top Layer w0.152: U3.90 v3(62.85,43.7)
  Bottom Layer w0.152: v3(62.85,43.7) 70.62,43.7 78.92,35.4 RN14.5
PIN_0: length 28.2
  Top Layer w0.152: 56.24,54.52 v3(56.24,56.38)
  Bottom Layer w0.152: v3(56.24,56.38) 56.24,57.7 57.66,59.12 69.41,59.12 74.27,63.98 74.27,66.55 H1.34
PIN_1: length 23.8
  Top Layer w0.152: 55.74,54.52 v3(55.74,55.82)
  Bottom Layer w0.152: v3(55.74,55.82) 55.74,58.09 57.34,59.69 67.36,59.69 H1.33
PIN_2: length 25.9
  Top Layer w0.152: 52.74,54.52 v3(52.74,56.38)
  Bottom Layer w0.152: H1.30 69.17,66.57 69.17,64.62 64.79,60.24 55.83,60.24 52.74,57.14 v3(52.74,56.38)
PIN_3: length 21.8
  Top Layer w0.152: 52.24,54.52 v3(52.24,55.85)
  Bottom Layer w0.152: H1.29 63.41,60.82 55.71,60.82 52.24,57.35 v3(52.24,55.85)
PIN_4: length 22.7
  Top Layer w0.152: 51.74,54.52 v3(51.74,56.38)
  Bottom Layer w0.152: v3(51.74,56.38) 51.74,57.56 55.54,61.36 61.79,61.36 64,63.57 64,66.89 63.04,67.84 H1.26
PIN_5: length 18.7
  Top Layer w0.152: 51.24,54.52 v3(51.24,55.84)
  Bottom Layer w0.152: H1.25 62.81,64 60.67,61.85 55.32,61.85 51.24,57.76 v3(51.24,55.84)
PIN_6: length 20.9
  Top Layer w0.152: 50.74,54.52 v3(50.74,56.38)
  Bottom Layer w0.152: 55.1,62.34 59.57,62.34 59.58,62.33 61.53,64.28 61.53,66.59 H1.24 ; v3(50.74,56.38) 50.74,57.97 55.1,62.33
PIN_7: length 17.2
  Top Layer w0.152: 50.24,54.52 v3(50.24,55.84)
  Bottom Layer w0.152: H1.23 60.27,64.34 58.76,62.83 54.9,62.83 ; v3(50.24,55.84) 50.24,58.18 54.9,62.84
PIN_8: length 19.7
  Top Layer w0.152: 49.74,54.52 v3(49.74,56.38)
  Bottom Layer w0.152: 54.62,63.27 49.74,58.39 v3(49.74,56.38) ; 54.62,63.32 58.08,63.32 59.03,64.27 59.03,66.55 H1.22
PIN_9: length 15.8
  Top Layer w0.152: 49.24,54.52 v3(49.24,55.82)
  Bottom Layer w0.152: H1.21 57.73,64.53 57.02,63.81 54.45,63.81 49.24,58.59 v3(49.24,55.82)
PIN_10: length 16
  Top Layer w0.152: 48.74,54.52 48.74,56.32 v2(48.76,56.34)
  Bottom Layer w0.152: H1.18 53.93,66.57 53.93,63.96 48.76,58.79 v2(48.76,56.34)
PIN_11: length 13
  Top Layer w0.152: 47.24,54.52 47.24,59.89 H1.17
PIN_12: length 14.7
  Top Layer w0.152: 46.74,54.52 46.74,61.94 48.86,64.06 48.86,66.59 H1.16
PIN_13: length 12.6
  Top Layer w0.152: 45.74,54.52 v3(45.74,55.82)
  Bottom Layer w0.152: v3(45.74,55.82) 45.74,59.9 50.11,64.28 H1.15
PIN_14: length 14.3
  Top Layer w0.152: 45.24,54.52 v3(45.24,56.38)
  Bottom Layer w0.152: H1.12 45.03,67.44 46.3,66.17 46.3,64.02 45.24,62.96 v3(45.24,56.38)
PIN_15: length 10.9
  Top Layer w0.152: 44.74,54.52 v3(44.74,55.82)
  Bottom Layer w0.152: v3(44.74,55.82) 44.74,63.54 45.03,63.83 H1.11
PIN_16: length 15.1
  Top Layer w0.152: 44.24,54.52 v3(44.24,56.38)
  Bottom Layer w0.152: v3(44.24,56.38) 44.24,61.04 41.2,64.08 41.2,66.6 H1.8
PIN_17: length 12.3
  Top Layer w0.152: 43.74,54.52 v3(43.74,55.82)
  Bottom Layer w0.152: v3(43.74,55.82) 43.74,59.63 39.95,63.42 H1.7
SW0: length 28.2
  Top Layer w0.152: U3.89 v3(63.4,43.2)
  Bottom Layer w0.152: RN1.8 72.27,25.25 69.77,27.75 69.77,39.87 66.44,43.2 v3(63.4,43.2)
SW1: length 27.2
  Top Layer w0.152: U3.88 v3(62.86,42.7)
  Bottom Layer w0.152: v3(62.86,42.7) 66.23,42.7 69.27,39.66 69.27,27.24 71.47,25.04 RN1.7
SW2: length 26.3
  Top Layer w0.152: U3.87 v3(63.4,42.2)
  Bottom Layer w0.152: RN1.6 70.67,24.84 68.77,26.74 68.77,39.46 66.02,42.2 v3(63.4,42.2)
SW3: length 25.4
  Top Layer w0.152: U3.86 v3(62.86,41.7)
  Bottom Layer w0.152: v3(62.86,41.7) 65.81,41.7 68.27,39.25 68.27,26.23 69.87,24.63 RN1.5
  Bottom Layer w0.2: RN1.5 69.9,22.35
SW4: length 24.1
  Top Layer w0.152: U3.85 v3(63.4,41.2)
  Bottom Layer w0.152: v3(63.4,41.2) 65.61,41.2 67.77,39.04 67.77,25.13 67.06,24.42 RN2.8
SW5: length 23.4
  Top Layer w0.152: U3.84 v3(62.87,40.7)
  Bottom Layer w0.152: v3(62.87,40.7) 65.4,40.7 67.27,38.83 67.27,25.22 66.26,24.21 66.26,22.32
SW6: length 20.7
  Top Layer w0.152: U3.81 v3(62.84,39.2)
  Bottom Layer w0.152: RN2.6 65.46,23.59 65.77,23.9 65.77,38.21 64.78,39.2 v3(62.84,39.2)
SW7: length 20
  Top Layer w0.152: U3.80 v3(63.4,38.7)
  Bottom Layer w0.152: 64.66,22.32 64.66,23.39 65.27,23.99 65.27,38.01 64.57,38.7 v3(63.4,38.7)
SW8: length 20.1
  Top Layer w0.152: U3.79 v3(62.84,38.2)
  Bottom Layer w0.152: RN3.8 61.85,25.04 64.77,27.96 64.77,37.8 64.37,38.2 v3(62.84,38.2)
SW9: length 19.4
  Top Layer w0.152: U3.78 v3(63.4,37.7)
  Bottom Layer w0.152: RN3.7 61.05,25.25 64.27,28.46 64.27,37.59 64.16,37.7 v3(63.4,37.7)
TCK: length 50.3
  Top Layer w0.254: R19.1 35.5,58.12 35.5,60.3 34.78,61.02 29.6,61.02 24.74,65.88 H2.1 ; v3(42.23,45.19) 40.44,45.19 U3.16
  Bottom Layer w0.254: v3(42.23,45.19) 42.23,50.82 27.17,65.88 H2.1
TDI: length 40.8
  Top Layer w0.254: U3.17 38.91,44.7 38.87,44.74 v3(38.87,44.77) 33,50.64 33,56.09 32.23,56.86 30.59,56.86 R21.1 26.09,61.35 15.34,61.35 14.1,62.59 14.1,64.79 13.01,65.88 H2.9
TDO: length 35.9
  Top Layer w0.254: v3(42.26,44.19) 42.25,44.2 U3.18
  Bottom Layer w0.254: v3(42.26,44.19) 41.53,44.92 41.53,50.5 27.43,64.6 21.59,64.6 20.52,65.67 H2.3
TMS: length 35.3
  Top Layer w0.254: H2.5 17.98,65.26 18.66,64.58 24.84,64.58 R20.1 30.52,58.9 33,58.9 33.78,58.12 33.78,51.05 v3(39.1,45.73) 39.12,45.7 40.43,45.7 U3.15
$2N232: length 5.3
  Top Layer w0.201: 11.47,54.02 10.03,52.58 6.81,52.58
$2N233: length 9
  Top Layer w0.201: 14.38,53.94 14.38,53.17 14.02,52.81 11.31,52.81 10.08,51.58 6.81,51.58
$2N467: length 3
  Top Layer w0.254: LED10.2 14.23,50.63 R3.2
$5N780: length 30.7
  Bottom Layer w0.254: RN1.1 72.3,20.69 72.3,19.64 73.41,18.53 89.33,18.53 92.24,15.62 92.24,12.14 SW0.2
$5N782: length 21.8
  Bottom Layer w0.254: 64.66,20.72 64.66,17.75 64.15,17.24 56.62,17.24 54.2,14.82 54.2,12.02 SW7.2
$5N783: length 31.4
  Bottom Layer w0.254: SW9.2 41.41,11.9 41.41,16.94 43.2,18.73 60.65,18.73 61.05,19.14 RN3.2
$5N784: length 25.1
  Bottom Layer w0.254: SW8.2 47.89,12.04 47.89,15.46 50.33,17.9 61.04,17.9 61.85,18.72 RN3.1
$5N785: length 15.1
  Bottom Layer w0.254: RN1.4 69.87,18.05 71.26,16.66 72.31,16.66 73.24,15.73 73.24,12.13 SW3.2
$5N786: length 13.1
  Bottom Layer w0.254: SW4.2 67.06,11.97 RN2.1
$5N787: length 20.3
  Bottom Layer w0.254: RN1.3 70.67,18.57 71.88,17.36 77.79,17.36 79.29,15.86 79.29,12.41 SW2.2
$5N788: length 26.1
  Bottom Layer w0.254: SW1.2 85.71,12.33 85.71,16.78 84.54,17.95 72.58,17.95 71.47,19.06 RN1.2
$5N789: length 12.8
  Bottom Layer w0.254: 66.26,20.72 66.26,11.41 SW5.2
$5N790: length 16.8
  Bottom Layer w0.254: SW6.2 60.65,12.13 60.65,15.55 61.72,16.62 64.66,16.62 65.46,17.42 RN2.3
$5N1435: length 5.8
  Top Layer w0.254: R12.1 70.42,54.34 68.56,56.2 68.56,56.6
$5N1437: length 7.6
  Top Layer w0.254: D2.2 73.18,52.1 BUZZER1.2 73.16,53.52 Q1.3
$5N1571: length 2.3
  Top Layer w0.254: R22.2 34.63,36.31 OSC1.3
$6N1755: length 4.1
  Top Layer w0.254: LED0.2 57.61,22.33 R8.2
$6N1756: length 4.1
  Top Layer w0.254: R13.2 51.71,22.22 LED1.2
$6N1757: length 4.1
  Top Layer w0.254: LED2.2 45.67,22.24 R9.2
$6N1758: length 4.1
  Top Layer w0.254: R10.2 33.6,22.27 LED4.2
$6N1759: length 4.1
  Top Layer w0.254: 39.64,18.52 39.64,22.25 LED3.2
$6N1760: length 4.1
  Top Layer w0.254: LED5.2 27.56,22.28 R15.2
$6N1761: length 4.1
  Top Layer w0.254: LED6.2 21.53,22.3 R11.2
$6N1762: length 4.1
  Top Layer w0.254: LED7.2 15.49,22.31 R16.2
$6N1767: length 4.1
  Top Layer w0.254: LED8.2 9.46,22.33 R17.2
$6N1768: length 4.1
  Top Layer w0.254: R18.2 3.42,22.34 LED9.2
$6N4229: length 13.9
  Bottom Layer w0.201: HEX1.7 23.37,8.18 23.37,15.11 25.27,17.02 RN9.4
$6N4231: length 5.6
  Bottom Layer w0.201: 27.67,18.37 27.67,15.98 25.43,13.74
$6N4232: length 8.7
  Bottom Layer w0.201: 25.43,11.2 24.37,12.26 24.37,14.36 26.87,16.86 26.87,18.37
$6N4233: length 11.3
  Bottom Layer w0.201: RN9.3 26.07,16.89 23.87,14.68 23.87,10.24 23.86,10.23 HEX1.8
$6N4234: length 10.5
  Bottom Layer w0.2: 28.52,8.66 30.06,10.19 30.06,16.36 30.33,16.64 RN10.3
$6N4235: length 7.6
  Bottom Layer w0.2: RN10.4 29.56,18.34 29.56,12.24 28.52,11.2
$6N4236: length 16.2
  Bottom Layer w0.201: 28.52,3.58 31.04,6.1 31.04,15.64 31.93,16.53 RN10.1
$6N4237: length 13.3
  Bottom Layer w0.201: 28.52,6.12 30.55,8.15 30.55,16.04 31.13,16.63 RN10.2
$6N4238: length 10.4
  Bottom Layer w0.201: 21.86,18.28 21.86,10.17 HEX1.3 ; 21.9,18.28 21.81,18.37
$6N4239: length 7.7
  Bottom Layer w0.201: 20.35,11.2 21.36,12.21 21.36,14.57 21.01,14.93 RN8.4
$6N4241: length 13.2
  Bottom Layer w0.201: HEX1.4 20.35,6.22 22.35,8.22 ; RN8.2 22.61,16.01 22.37,15.77 22.37,8.22
$6N4242: length 16.1
  Bottom Layer w0.201: 20.35,3.58 22.87,6.09 22.87,15.54 23.44,16.11 23.44,18.34 23.41,18.37
$6N4277: length 5.4
  Bottom Layer w0.201: 17.26,13.74 17.26,14.16 19.1,16 19.1,18.32 RN7.1
$6N4278: length 8.5
  Bottom Layer w0.201: 17.26,11.2 16.15,12.31 16.15,14.38 18.34,16.58 RN7.2
$6N4279: length 11.2
  Bottom Layer w0.201: RN7.3 17.51,18.33 17.51,16.49 15.66,14.64 15.66,10.25 ; HEX2.8 15.67,10.25
$6N4280: length 13.8
  Bottom Layer w0.201: RN7.4 16.73,18.35 16.73,16.52 15.18,14.97 15.18,8.2 HEX2.7
$6N4282: length 14
  Bottom Layer w0.201: RN11.4 33.8,17.48 31.54,15.22 31.54,8.18 HEX0.7
$6N4285: length 5.7
  Bottom Layer w0.2: 33.6,13.74 33.6,14.67 36.23,17.3 36.23,18.34 RN11.1
$6N4286: length 8.8
  Bottom Layer w0.2: RN11.2 35.4,17.32 32.53,14.45 32.53,12.27 33.6,11.2
$6N4287: length 11.4
  Bottom Layer w0.201: RN11.3 34.6,17.41 32.03,14.85 32.03,10.23 HEX0.8
$6N4310: length 10.5
  Bottom Layer w0.201: RN6.3 13.28,15.42 13.72,14.97 13.72,10.2 HEX2.3
$6N4311: length 8.2
  Bottom Layer w0.201: RN6.4 12.48,15.33 13.24,14.57 13.24,11.86 12.58,11.2 12.18,11.2
$6N4312: length 15.9
  Bottom Layer w0.201: 14.69,6.1 14.69,15.43 14.71,15.43 14.88,15.6 RN6.1 ; 12.18,3.58 14.71,6.1
$6N4313: length 13.1
  Bottom Layer w0.201: HEX2.4 14.21,8.14 14.21,18.37
$6N4315: length 5.3
  Bottom Layer w0.201: 9.09,13.74 10.62,15.27 RN5.1
$6N4316: length 8.4
  Bottom Layer w0.201: RN5.2 9.82,16.05 8.02,14.25 8.02,12.27 9.09,11.2
$6N4317: length 11
  Bottom Layer w0.201: RN5.3 9.02,16.17 7.52,14.67 7.52,10.23 HEX3.8
$6N4318: length 13.6
  Bottom Layer w0.201: RN5.4 8.22,16.24 7.02,15.04 7.02,8.19 HEX3.7
$6N4329: length 13.7
  Bottom Layer w0.201: RN4.2 5.55,15.76 6.02,15.29 6.02,7.47 4.67,6.12 HEX3.4
$6N4330: length 15.9
  Bottom Layer w0.201: RN4.1 6.35,15.62 6.52,15.46 6.52,6.09 4.01,3.58
$6N4331: length 10.9
  Bottom Layer w0.201: 4.75,18.37 4.75,15.62 5.52,14.85 5.52,9.75 4.44,8.66 HEX3.3
$6N4332: length 8.4
  Bottom Layer w0.201: 4.01,11.2 4.66,11.2 5.02,11.57 5.02,14.39 3.95,15.46 3.95,18.37
$7N869: length 7.6
  Bottom Layer w0.152: H4.8 88.37,36.62 85.47,36.62 84.25,35.4 RN14.4
$7N870: length 8
  Bottom Layer w0.152: RN12.2 83.63,53.38 85.78,55.53 88.37,55.53 H3.6
$7N871: length 7.8
  Bottom Layer w0.201: H3.8 89.63,54.01 88.61,52.99 85.96,52.99 84.75,51.78 RN12.4
$7N872: length 4.9
  Bottom Layer w0.201: RN13.1 85.14,61.87 H3.1
$7N933: length 4.7
  Bottom Layer w0.152: RN12.3 84.37,52.58 86.04,54.25 H3.7
$7N934: length 5.1
  Bottom Layer w0.152: H3.5 85.65,56.79 RN12.1
$7N935: length 4.5
  Bottom Layer w0.201: RN13.3 84.82,58.17 85.98,59.33 H3.3
$7N985: length 5.1
  Bottom Layer w0.152: RN14.1 85.67,40.42 H4.5
$7N986: length 8.2
  Bottom Layer w0.152: RN14.2 83.29,37.25 83.54,37.25 83.67,37.38 83.67,37.63 85.24,39.2 88.41,39.2 H4.6
$7N987: length 4.8
  Bottom Layer w0.152: H4.7 87.04,37.93 85.45,37.93 83.72,36.2 RN14.3
$7N989: length 7.4
  Bottom Layer w0.201: RN13.4 83.06,57.35 85.29,57.35 86.01,58.07 88.37,58.07 ; H3.4 88.37,58.07
$7N990: length 7.8
  Bottom Layer w0.201: RN13.2 84.19,58.97 85.7,60.48 88.24,60.48 H3.2
$7N1007: length 4.7
  Bottom Layer w0.201: H4.3 85.77,42.96 84.09,41.28 RN15.3
$7N1008: length 5.1
  Bottom Layer w0.201: H4.1 85.67,45.5 RN15.1
$7N1021: length 7.6
  Bottom Layer w0.201: H4.4 88.45,41.78 85.98,41.78 84.68,40.48 RN15.4
$7N1023: length 8
  Bottom Layer w0.201: RN15.2 83.44,42.08 85.61,44.25 88.38,44.25 H4.2

## Copper pours and planes (outline as drawn; the poured copper is in the pictures)
3.3V on Top Layer: 16.86,53.88 19.21,53.88 19.21,53.35 16.86,53.35
3.3V on Top Layer: 25.07,55.84 31.83,55.84 31.83,45.71 25.07,45.71
3.3V on Top Layer: 72.28,59.23 77.16,59.23 77.16,48.44 72.28,48.44
3.3V on Inner2: 0.25,69.74 99.69,69.74 99.69,0.26 0.25,0.26
3.3VA on Bottom Layer: 46.81,39.49 46.81,46.46 48.07,47.72 48.81,47.72 48.81,46.87 48.79,46.85 50.08,45.56 54.57,45.56 55,45.99 55.01,45.99 55.15,46.13 55.15,46.66 55.28,46.79 56.16,46.79 56.16,38.56 56.08,38.48 55.2,38.48 55.18,38.5 55.18,40.17 54.71,40.64 48.67,40.64 47.62,39.59 47.62,38.69 47.58,38.65 46.91,38.65 46.83,38.73 46.83,39.51
5VF on Top Layer: 16.85,52.95 19.28,52.95 19.28,45.68 16.85,45.68
5VF on Top Layer: 10.98,49.07 19.28,49.07 19.28,43.03 10.98,43.03
+5V on Top Layer: 4.1,41.22 15.36,41.22 15.36,39.59 4.1,39.59
+5V on Bottom Layer: 4.12,40.96 8.76,40.96 8.76,39.62 4.12,39.62
GND on Top Layer: 0.93,66.99 0.95,67.27 1.01,67.55 1.11,67.82 1.24,68.07 1.41,68.3 1.62,68.5 1.84,68.67 2.1,68.81 2.36,68.91 2.64,68.97 2.93,68.99 96.93,68.99 97.21,68.97 97.49,68.91 97.76,68.81 98.01,68.67 98.24,68.5 98.44,68.3 98.61,68.07 98.75,67.82 98.84,67.55 98.91,67.27 98.93,66.99 98.93,2.99 98.91,2.71 98.84,2.43 98.75,2.16 98.61,1.91 98.44,1.68 98.24,1.48 98.01,1.31 97.76,1.17 97.49,1.07 97.21,1.01 96.93,0.99 2.93,0.99 2.64,1.01 2.36,1.07 2.1,1.17 1.84,1.31 1.62,1.48 1.41,1.68 1.24,1.91 1.11,2.16 1.01,2.43 0.95,2.71 0.93,2.99
GND on Bottom Layer: 0.95,67 0.97,67.28 1.03,67.56 1.13,67.83 1.26,68.08 1.43,68.31 1.64,68.51 1.86,68.68 2.12,68.82 2.38,68.92 2.66,68.98 2.95,69 96.95,69 97.23,68.98 97.51,68.92 97.78,68.82 98.03,68.68 98.26,68.51 98.46,68.31 98.63,68.08 98.77,67.83 98.86,67.56 98.93,67.28 98.95,67 98.95,3 98.93,2.72 98.86,2.44 98.77,2.17 98.63,1.92 98.46,1.69 98.26,1.49 98.03,1.32 97.78,1.18 97.51,1.08 97.23,1.02 96.95,1 2.95,1 2.66,1.02 2.38,1.08 2.12,1.18 1.86,1.32 1.64,1.49 1.43,1.69 1.26,1.92 1.13,2.17 1.03,2.44 0.97,2.72 0.95,3
GND on Inner1: 0.25,69.74 99.69,69.74 99.69,0.26 0.25,0.26
$2N798 on Top Layer: 22.18,55.84 23.95,55.84 23.95,51.76 22.18,51.76
$2N798 on Top Layer: 20.91,55.84 22.51,55.84 22.51,54.95 20.91,54.95
$2N798 on Top Layer: 20.53,52.94 22.39,52.94 22.39,52.4 20.53,52.4
$2N800 on Top Layer: 19.52,55.85 21.63,55.85 21.63,53.35 19.52,53.35

Small or netless copper shapes (teardrops, artwork), in the pictures only: 1 on Top Layer

## Text on the board
Bottom Silkscreen Layer: DISEÑADA Y / ENSAMBLADA EN NAYARIT
Top Silkscreen Layer: 3.3 | GND | 140 | 141 | 138 | 139 | 135 | 137 | 131 | 134 | 129 | 130 | 127 | 128 | 125 | 126 | 123 | 124 | 116 | 117 | off | on | LOGIC LAB + / BY POCKET LABS
